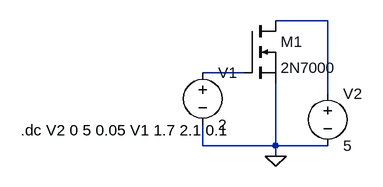
[diagram p0: schematic Draft2.asc]
Draft2.asc, the LTspice schematic file:
Version 4
SHEET 1 880 680
WIRE 304 112 224 112
WIRE 176 192 112 192
WIRE 304 224 304 112
WIRE 112 304 112 272
WIRE 224 304 224 208
WIRE 224 304 112 304
WIRE 304 304 224 304
WIRE 224 320 224 304
FLAG 224 320 0
SYMBOL nmos 176 112 R0
SYMATTR InstName M1
SYMATTR Value 2N7000
SYMBOL voltage 304 208 R0
WINDOW 123 0 0 Left 2
WINDOW 39 0 0 Left 2
SYMATTR InstName V2
SYMATTR Value 5
SYMBOL voltage 112 176 R0
WINDOW 123 0 0 Left 2
WINDOW 39 0 0 Left 2
SYMATTR InstName V1
SYMATTR Value 2
TEXT -168 280 Left 2 !.dc V2 0 5 0.05 V1 1.7 2.1 0.1

The netlist it stands for:
* Draft2.asc
M1 N001 N002 0 0 2N7000
V2 N001 0 5
V1 N002 0 2
.model NMOS NMOS
.model PMOS PMOS
.lib standard.mos
.dc V2 0 5 0.05 V1 1.7 2.1 0.1
.backanno
.end